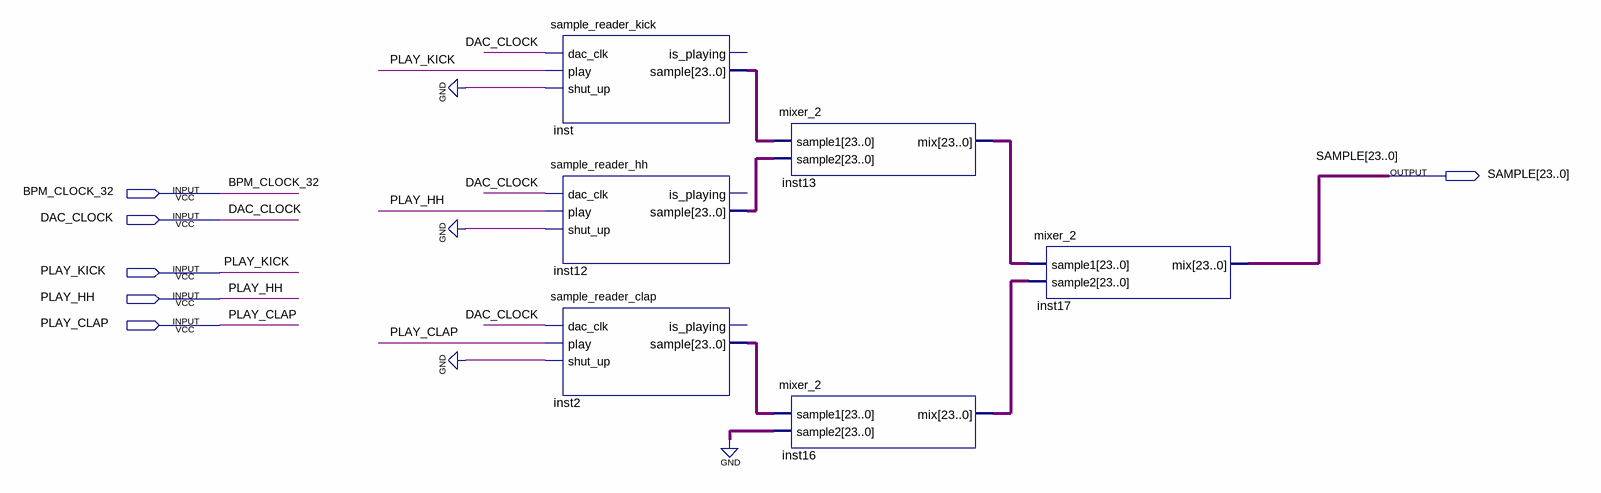
[diagram p0: schematic sheet]
// Quartus schematic sample_readers.bdf as structural Verilog: 6 symbols, 6 pins
module sample_readers (
  input  BPM_CLOCK_32,
  input  DAC_CLOCK,
  input  PLAY_KICK,
  input  PLAY_HH,
  input  PLAY_CLAP,
  output [23:0] SAMPLE
);

  wire [23:0] inst2_sample, inst12_sample, inst13_mix, inst16_mix, inst_sample;

  sample_reader_kick inst (
    .dac_clk(DAC_CLOCK), .play(PLAY_KICK), .shut_up(1'b0), .sample(inst_sample));  // open: is_playing
  sample_reader_hh inst12 (
    .dac_clk(DAC_CLOCK), .play(PLAY_HH), .shut_up(1'b0), .sample(inst12_sample));  // open: is_playing
  sample_reader_clap inst2 (
    .dac_clk(DAC_CLOCK), .play(PLAY_CLAP), .shut_up(1'b0), .sample(inst2_sample));  // open: is_playing
  mixer_2 inst13 (.sample1(inst_sample), .sample2(inst12_sample), .mix(inst13_mix));
  mixer_2 inst16 (.sample1(inst2_sample), .sample2({24{1'b0}}), .mix(inst16_mix));
  mixer_2 inst17 (.sample1(inst13_mix), .sample2(inst16_mix), .mix(SAMPLE));
endmodule
